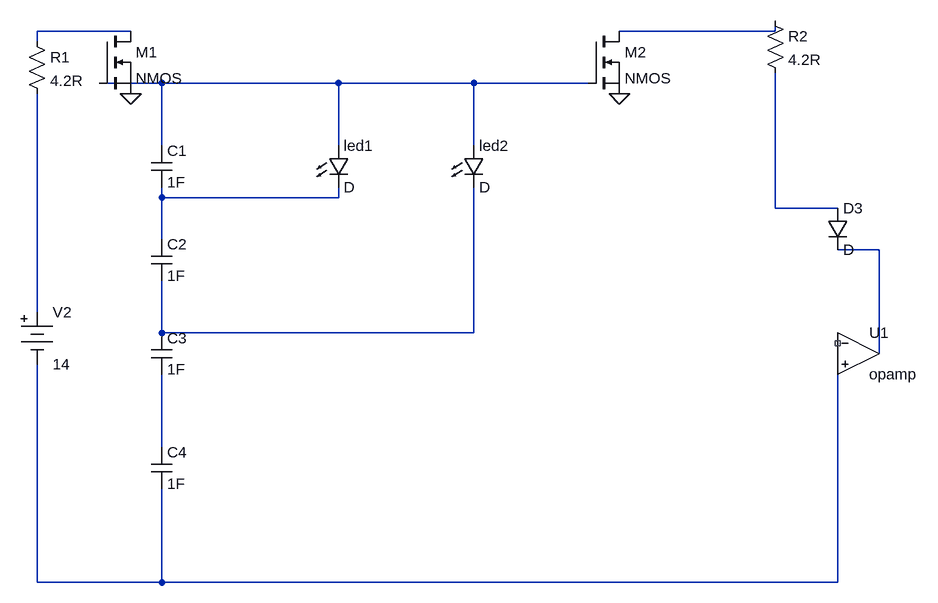
[diagram p0: schematic ev.asc]
ev.asc, the LTspice schematic file:
Version 4
SHEET 1 1384 788
WIRE 224 -112 80 -112
WIRE 1216 -112 1216 -128
WIRE 1216 -112 976 -112
WIRE 80 -96 80 -112
WIRE 272 -32 176 -32
WIRE 544 -32 272 -32
WIRE 752 -32 544 -32
WIRE 928 -32 752 -32
WIRE 272 64 272 -32
WIRE 544 64 544 -32
WIRE 752 64 752 -32
WIRE 272 144 272 128
WIRE 544 144 544 128
WIRE 544 144 272 144
WIRE 1216 160 1216 -48
WIRE 1312 160 1216 160
WIRE 272 208 272 144
WIRE 1376 224 1312 224
WIRE 80 320 80 -16
WIRE 272 352 272 272
WIRE 752 352 752 128
WIRE 752 352 272 352
WIRE 1376 384 1376 224
WIRE 272 528 272 416
WIRE 80 736 80 400
WIRE 272 736 272 592
WIRE 272 736 80 736
WIRE 1312 736 1312 400
WIRE 1312 736 272 736
FLAG 224 -16 0
FLAG 976 -16 0
SYMBOL res 64 -112 R0
SYMATTR InstName R1
SYMATTR Value 4.2R
SYMATTR SpiceLine pwr=4.2
SYMBOL diode 1296 160 R0
SYMATTR InstName D3
SYMBOL OpAmps\\opamp 1344 320 R0
SYMATTR InstName U1
SYMBOL Misc\\battery 80 304 R0
WINDOW 123 0 0 Left 0
WINDOW 39 0 0 Left 0
SYMATTR InstName V2
SYMATTR Value 14
SYMBOL cap 256 64 R0
SYMATTR InstName C1
SYMATTR Value 1F
SYMBOL cap 256 208 R0
SYMATTR InstName C2
SYMATTR Value 1F
SYMBOL cap 256 352 R0
SYMATTR InstName C3
SYMATTR Value 1F
SYMBOL cap 256 528 R0
SYMATTR InstName C4
SYMATTR Value 1F
SYMBOL LED 528 64 R0
SYMATTR InstName led1
SYMBOL LED 736 64 R0
SYMATTR InstName led2
SYMBOL res 1200 -144 R0
SYMATTR InstName R2
SYMATTR Value 4.2R
SYMATTR SpiceLine pwr=4.2
SYMBOL nmos 176 -112 R0
SYMATTR InstName M1
SYMBOL nmos 928 -112 R0
SYMATTR InstName M2

The netlist it stands for:
* ev.asc
R1 N001 N007 4.2R pwr=4.2
D3 N005 N006 D
XU1 NC_01 N010 N006 opamp Aol=100K GBW=10Meg  ; pins invin noninvin out
V2 N007 N010 14
C1 N003 N004 1F
C2 N004 N008 1F
C3 N008 N009 1F
C4 N009 N010 1F
D§led1 N003 N004 D
D§led2 N003 N008 D
R2 N002 N005 4.2R pwr=4.2
M1 N001 N003 0 0 NMOS
M2 N002 N003 0 0 NMOS
.model D D
.lib standard.dio
.model NMOS NMOS
.model PMOS PMOS
.lib standard.mos
.backanno
.end